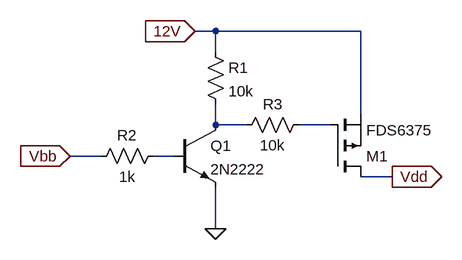
[diagram p0: schematic PMOS_5VL_12VP_HSS.asc]
PMOS_5VL_12VP_HSS.asc, the LTspice schematic file:
Version 4
SHEET 1 1336 680
WIRE 960 -64 928 -64
WIRE 1184 -64 960 -64
WIRE 960 -32 960 -64
WIRE 1184 64 1184 -64
WIRE 960 80 960 48
WIRE 1008 80 960 80
WIRE 1136 80 1088 80
WIRE 784 128 736 128
WIRE 896 128 864 128
WIRE 1232 160 1184 160
WIRE 960 240 960 176
FLAG 960 240 0
FLAG 736 128 Vbb
IOPIN 736 128 In
FLAG 928 -64 12V
IOPIN 928 -64 In
FLAG 1232 160 Vdd
IOPIN 1232 160 Out
SYMBOL npn 896 80 R0
SYMATTR InstName Q1
SYMATTR Value 2N2222
SYMBOL res 944 -48 R0
SYMATTR InstName R1
SYMATTR Value 10k
SYMBOL res 880 112 R90
WINDOW 0 0 56 VBottom 2
WINDOW 3 32 56 VTop 2
SYMATTR InstName R2
SYMATTR Value 1k
SYMBOL pmos 1136 160 M180
SYMATTR InstName M1
SYMATTR Value FDS6375
SYMBOL res 1104 64 R90
WINDOW 0 0 56 VBottom 2
WINDOW 3 32 56 VTop 2
SYMATTR InstName R3
SYMATTR Value 10k

The netlist it stands for:
* PMOS_5VL_12VP_HSS.asc
Q1 N001 N003 0 0 2N2222
R1 12V N001 10k
R2 N003 Vbb 1k
M1 Vdd N002 12V 12V FDS6375
R3 N002 N001 10k
.model NPN NPN
.model PNP PNP
.lib standard.bjt
.model NMOS NMOS
.model PMOS PMOS
.lib standard.mos
.backanno
.end